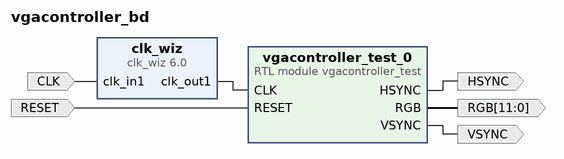
[diagram p0: block diagram of the top level]
# Vivado block design vgacontroller_bd, xc7a35tcpg236-1, Vivado 2023.2
create_bd_design vgacontroller_bd

create_bd_port -dir I -type clk CLK
create_bd_port -dir I -type rst RESET
create_bd_port -dir O VSYNC
create_bd_port -dir O HSYNC
create_bd_port -dir O -from 11 -to 0 RGB

create_bd_cell -type module -reference vgacontroller_test vgacontroller_test_0
create_bd_cell -type ip -vlnv xilinx.com:ip:clk_wiz:6.0 clk_wiz
set_property -dict [list \
  CONFIG.CLKOUT1_JITTER 143.858 \
  CONFIG.CLKOUT1_PHASE_ERROR 157.402 \
  CONFIG.CLKOUT1_REQUESTED_OUT_FREQ 150.000 \
  CONFIG.MMCM_CLKFBOUT_MULT_F 19.875 \
  CONFIG.MMCM_CLKOUT0_DIVIDE_F 6.625 \
  CONFIG.MMCM_DIVCLK_DIVIDE 2 \
  CONFIG.USE_LOCKED false \
  CONFIG.USE_RESET false \
] [get_bd_cells clk_wiz]

# ---- connections ----

connect_bd_net -net RESET_0_1 [get_bd_ports RESET] [get_bd_pins vgacontroller_test_0/RESET]
connect_bd_net -net clk_in1_0_1 [get_bd_ports CLK] [get_bd_pins clk_wiz/clk_in1]
connect_bd_net [get_bd_pins clk_wiz/clk_out1] [get_bd_pins vgacontroller_test_0/CLK]
connect_bd_net [get_bd_pins vgacontroller_test_0/HSYNC] [get_bd_ports HSYNC]
connect_bd_net [get_bd_pins vgacontroller_test_0/RGB] [get_bd_ports RGB]
connect_bd_net [get_bd_pins vgacontroller_test_0/VSYNC] [get_bd_ports VSYNC]

validate_bd_design
save_bd_design
